# Altium project PCrs_30.PrjPcb
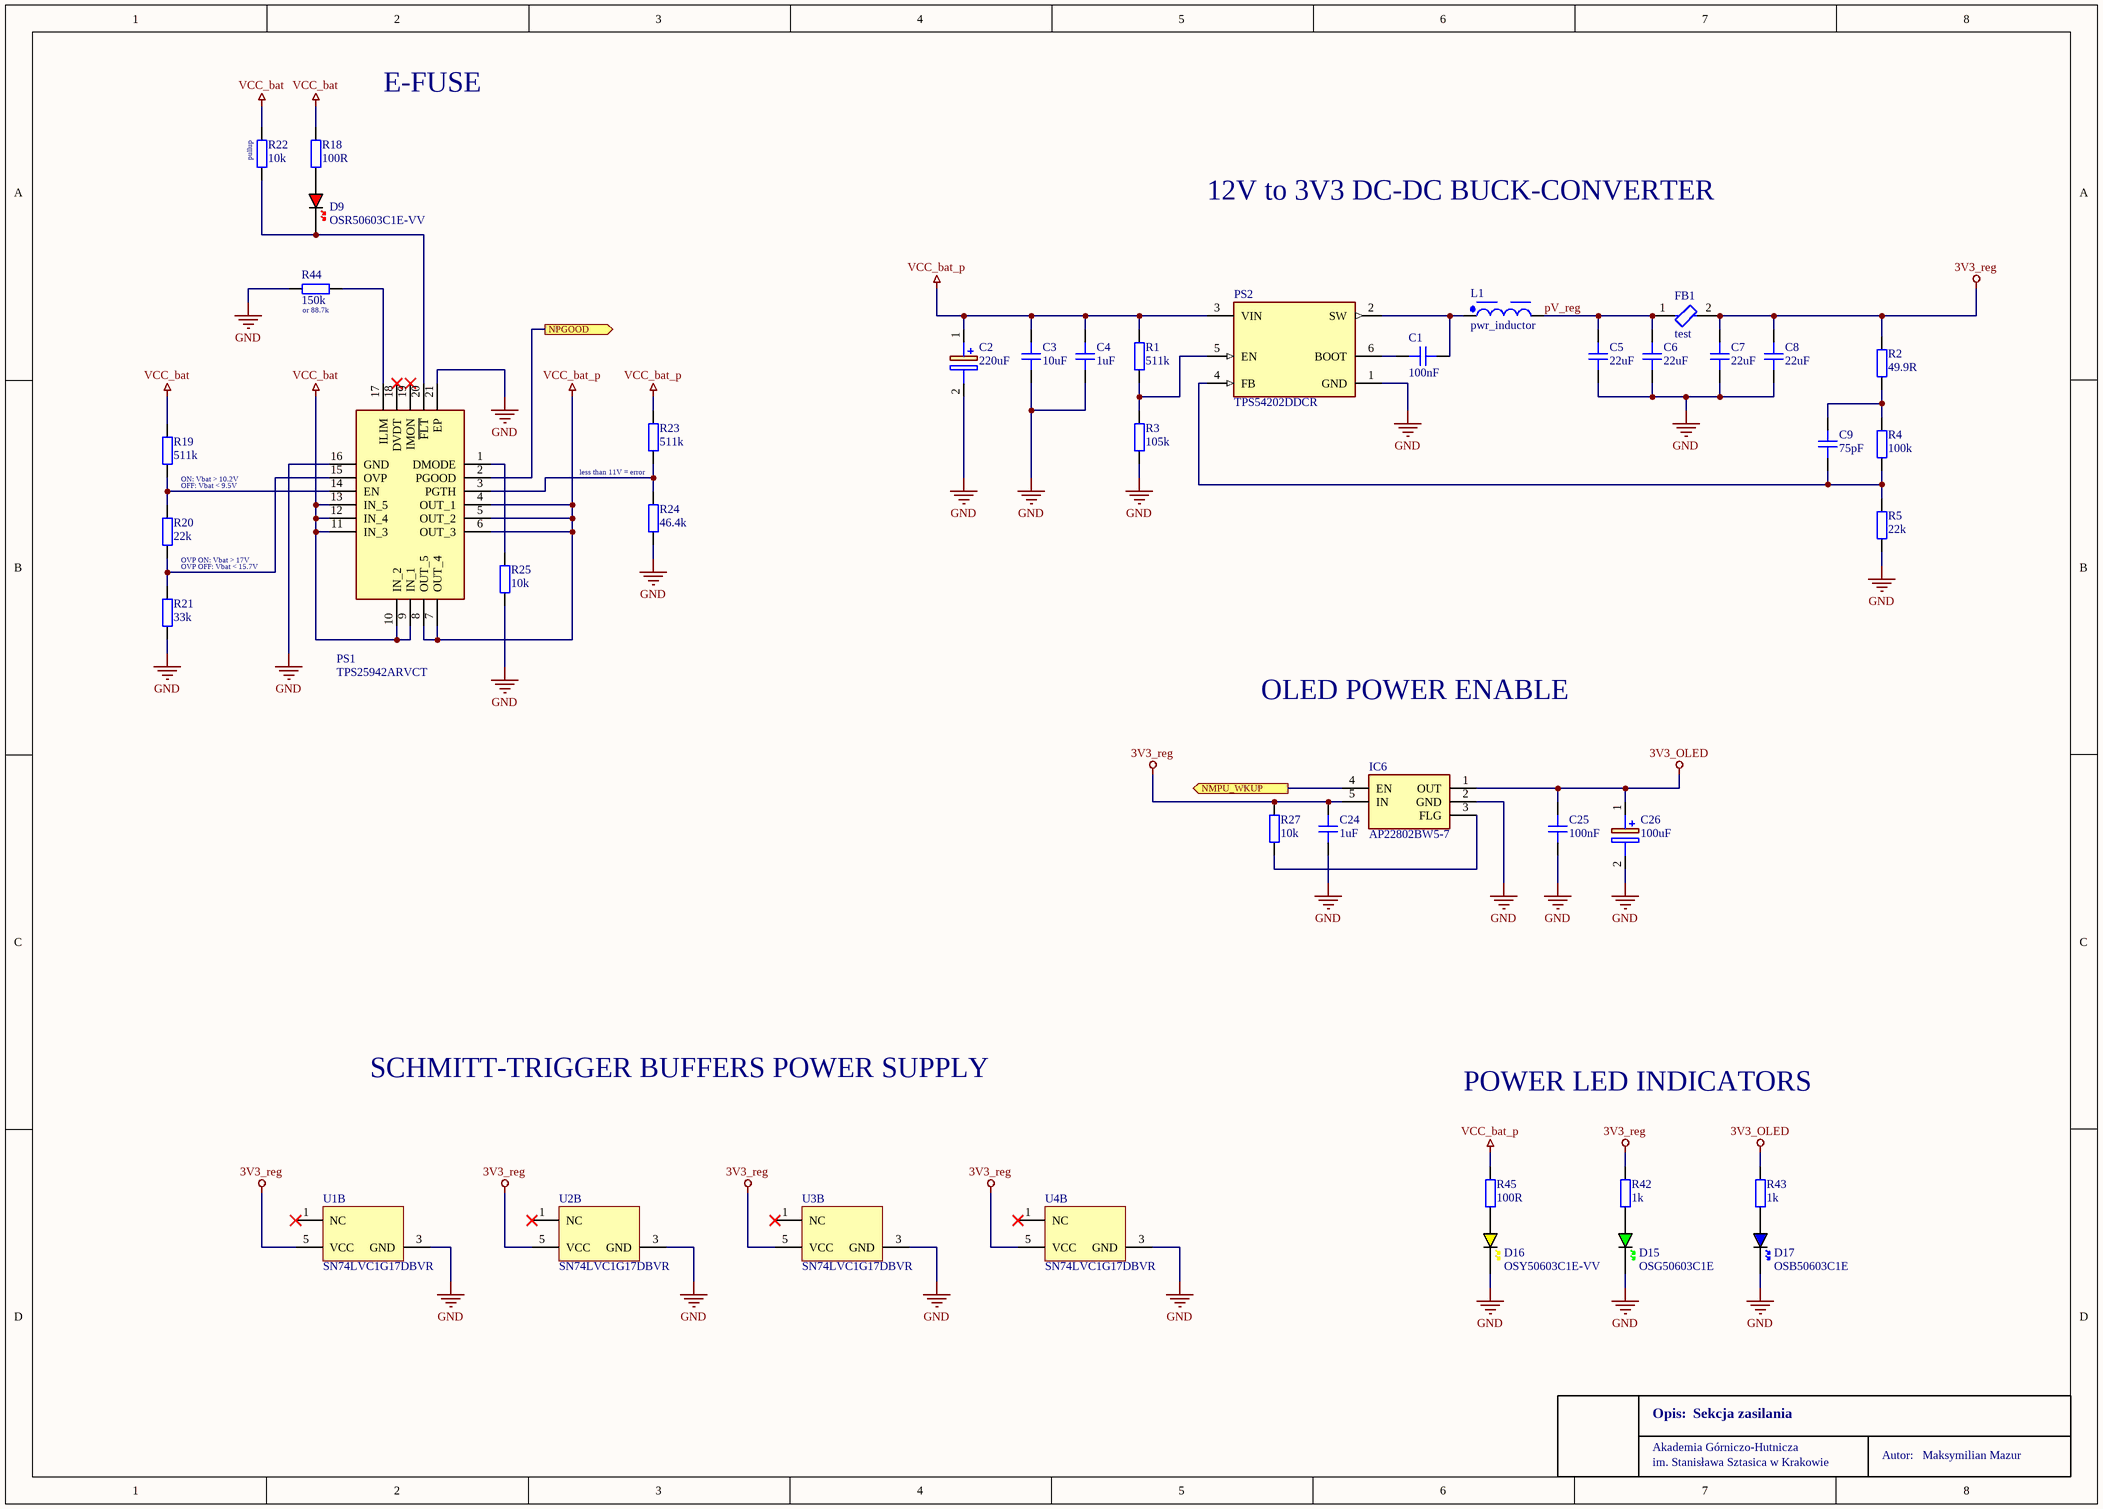
[diagram p0: PowerSupply.SchDoc]
3 sheets, 102 parts. Net scope: flat (ports and power ports of the same name join across sheets).
Board file: Mainboard.PcbDoc
Sheets:
  PowerSupply.SchDoc
  Connectors.SchDoc
  Buffers.SchDoc

## Sheet PowerSupply.SchDoc
size A3; SheetNumber: 1; SheetTotal: 4

### Parts
C1  100nF  [CAP_0603]
C2  220uF  [CAPAE660X810N]
C3  10uF  [CAP_1206]
C4  1uF  [CAP_0603]
C5  22uF  [CAP_0603]
C6  22uF  [CAP_0603]
C7  22uF  [CAP_0603]
C8  22uF  [CAP_0603]
C9  75pF  [CAP_0603]
C24  1uF  [CAP_0603]
C25  100nF  [CAP_0603]
C26  100uF  [CAPPM3528X210N]
D9  OSR50603C1E-VV  [LED_0603_RED]
D15  OSG50603C1E  [LED_0603_GREEN]
D16  OSY50603C1E-VV  [LED_0603_YELLOW]
D17  OSB50603C1E  [LED_0603_BLUE]
FB1  test  [FP-BLM18-0_15-t0_8-IPC_A]
IC6  AP22802BW5-7  [SOT95P285X140-5N]
L1  pwr_inductor  [WE-PD_7345]
PS1  TPS25942ARVCT  [QFN50P300X400X80-21N]
PS2  TPS54202DDCR  [FP-DDC0006A-IPC_B]
R1  511k  [RES_0603]
R2  49.9R  [RES_0603]
R3  105k  [RES_0603]
R4  100k  [RES_0603]
R5  22k  [RES_0603]
R18  100R  [RES_0603]
R19  511k  [RES_0603]
R20  22k  [RES_0603]
R21  33k  [RES_0603]
R22  10k  [RES_0603]
R23  511k  [RES_0603]
R24  46.4k  [RES_0603]
R25  10k  [RES_0603]
R27  10k  [RES_0603]
R42  1k  [RES_0603]
R43  1k  [RES_0603]
R44  150k  [RES_0603]
R45  100R  [RES_0603]
U1  SN74LVC1G17DBVR  [DBV0005A_L]  (part B of 2)
U2  SN74LVC1G17DBVR  [DBV0005A_L]  (part B of 2)
U3  SN74LVC1G17DBVR  [DBV0005A_L]  (part B of 2)
U4  SN74LVC1G17DBVR  [DBV0005A_L]  (part B of 2)

### Ports
NMPU_WKUP (out, see Buffers[3C], MPU[5C]), NPGOOD (out, see MPU[5C])

### Nets
3V3_OLED: C25.2 C26.1(+) IC6.1(OUT) R43.2
3V3_reg: C7.2 C8.2 C24.2 FB1.2 IC6.5(IN) R2.2 R27.2 R42.2 U1.5(VCC) U2.5(VCC) U3.5(VCC) U4.5(VCC)  [project net VDD]
GND: C2.2(-) C3.1 C4.1 C5.1 C6.1 C7.1 C8.1 C24.1 C25.1 C26.2(-) D15.K D16.K D17.K IC6.2(GND) PS1.16(GND) PS1.21(EP) PS2.1(GND) R3.1 R5.2 R21.1 R24.1 R25.1 R44.2 U1.3(GND) U2.3(GND) U3.3(GND) U4.3(GND)
VCC_bat: PS1.9(IN_1) PS1.10(IN_2) PS1.11(IN_3) PS1.12(IN_4) PS1.13(IN_5) R18.2 R19.2 R22.2  [project net VCC_bat_con]
VCC_bat_p: C2.1(+) C3.2 C4.2 PS1.4(OUT_1) PS1.5(OUT_2) PS1.6(OUT_3) PS1.7(OUT_4) PS1.8(OUT_5) PS2.3(VIN) R1.2 R23.2 R45.2
pV_reg: C5.2 C6.2 FB1.1 L1.2
NetC1_1: C1.1 L1.1 PS2.2(SW)
NetC1_2: C1.2 PS2.6(BOOT)
NetC9_1: C9.1 PS2.4(FB) R4.1 R5.1
NetC9_2: C9.2 R2.1 R4.2
NetD9_A: D9.A R18.1
NetD9_K: D9.K PS1.20(~{FLT}) R22.1
NetD15_A: D15.A R42.1
NetD16_A: D16.A R45.1
NetD17_A: D17.A R43.1
NetIC6_3: IC6.3(FLG) R27.1
NetIC6_4: IC6.4(EN) ; port NMPU_WKUP
NetPS1_1: PS1.1(DMODE) R25.2
NetPS1_2: PS1.2(PGOOD) ; port NPGOOD
NetPS1_3: PS1.3(PGTH) R23.1 R24.2
NetPS1_14: PS1.14(EN) R19.1 R20.2
NetPS1_15: PS1.15(OVP) R20.1 R21.2
NetPS1_17: PS1.17(ILIM) R44.1
NetPS2_5: PS2.5(EN) R1.1 R3.2

Not connected (* = marked no-connect by the designer): PS1 18(DVDT)* 19(IMON)*; U1 1(NC)*; U2 1(NC)*; U3 1(NC)*; U4 1(NC)*

### Notes on the sheet
- E-FUSE
- (near R22) pullup
- 12V to 3V3 DC-DC BUCK-CONVERTER
- (near R44) or 88.7k
- (near R19) ON: Vbat > 10.2V
- OFF: Vbat < 9.5V
- less than 11V = error
- (near R20) OVP ON: Vbat > 17V
- OVP OFF: Vbat < 15.7V
- OLED POWER ENABLE
- SCHMITT-TRIGGER BUFFERS POWER SUPPLY
- POWER LED INDICATORS
- Akademia Górniczo-Hutnicza
- Opis:
- Sekcja zasilania
- Autor:
- Maksymilian Mazur
- im. Stanisława Sztasica w Krakowie

### Library data of the parts
C1 C5-C8 = CAP_0603: Capacitor SMD 0603 / X7R / LOW ESR; Manufacturer: *; Manufacturer Part Number: *; Distributor Link: *; LCSC: *; Rating: *; Dielectric: *
C2 = SC1C227M6L07KVR: Capacitor Polarised / 220uF 16V / SC1C227M6L07KVR; Manufacturer_Name: SAMWHA; Datasheet Link: https://octopart.com/datasheet/sc1c227m6l07kvr-samwha-30812620; Height: 8.1mm; Manufacturer_Part_Number: SC1C227M6L07KVR
C3 = CAP_1206: Capacitor SMD 1206 / 25V; Manufacturer: *; Manufacturer Part Number: *; Distributor Link: *; LCSC: *; Rating: *; Dielectric: *
C4 = CAP_0603: Capacitor SMD 0603 / 25V; Manufacturer: *; Manufacturer Part Number: *; Distributor Link: *; LCSC: *; Rating: *; Dielectric: *
C9 C24 C25 = CAP_0603: Capacitor SMD 0603; Manufacturer: *; Manufacturer Part Number: *; Distributor Link: *; LCSC: *; Rating: *; Dielectric: *
C26 = TAJB107M010RNJ: Kyocera AVX / TAJB107M010RNJ; Datasheet Link: http://datasheets.avx.com/TAJ.pdf; Height: 2.1mm; Manufacturer_Name: Kyocera AVX; Manufacturer_Part_Number: TAJB107M010RNJ; Mouser Part Number: 581-TAJB107M010R; Mouser Price/Stock: https://www.mouser.co.uk/ProductDetail/KYOCERA-AVX/TAJB107M010RNJ?qs=fdqkYiOtZpcLl77pdaUmPA%3D%3D; Arrow Part Number: TAJB107M010RNJ; Arrow Price/Stock: https://www.arrow.com/en/products/tajb107m010rnj/avx?utm_currency=USD&region=europe
D9 = LED_0603_RED: LED 0603 RED SMD / Model: OSR50603C1E
D15 = LED_0603_GREEN: LED 0603 GREEN SMD / OSG50603C1E
D16 = LED_0603_YELLOW: LED 0603 YELLOW SMD / OSY50603C1E-VV
D17 = LED_0603_BLUE: LED 0603 BLUE SMD
FB1 = CMP-0686-00557-7: Chip Ferrite Bead, 0603 / For testing purpose; Impedance: 120R; Frequency: 100MHz; Number of Circuits: 1; Max Current Rating: 2A; Shielding: Unshielded; Material: Steel; DC Resistance (DCR): 50mR; Tolerance: 25%; Case Code (Imperial): 0603; RoHS Compliant: Yes; Number of Pins: 2; Min Operating Temperature: -55°C; Case Code (Metric): 1608; Length: 1.6mm; Test Frequency: 100MHz; Max Operating Temperature: 125°C; Packaging: Tape and Reel; Termination: SMD/SMT; Lead Free: Lead Free; Max DC Current: 2A; Case/Package: 0603; Height: 0.8mm; Current Rating: 2A; Radiation Hardening: No; Core Material: Ferrite; DC Current: 2A; REACH SVHC: No SVHC; Package Quantity: 1; Depth: 0.8mm; Number of Lines: 1; Width: 0.8mm
IC6 = AP22802BW5-7: Integrated Circuit; Manufacturer_Name: Diodes Incorporated; Datasheet Link: https://www.diodes.com//assets/Datasheets/products_inactive_data/AP22802.pdf; Height: 1.4mm; Manufacturer_Part_Number: AP22802BW5-7; Mouser Part Number: 621-AP22802BW5-7; Mouser Price/Stock: https://www.mouser.co.uk/ProductDetail/Diodes-Incorporated/AP22802BW5-7?qs=4WD8WRWcnWvdREmNWulNnQ%3D%3D; Arrow Part Number: AP22802BW5-7; Arrow Price/Stock: https://www.arrow.com/en/products/ap22802bw5-7/diodes-incorporated?utm_currency=USD&region=asia
L1 = CMP-0227-00155-2: 15uF, 2.7A  HPI0630-150; NexarPartId: 31136509; Self Resonant Frequency: 9.5MHz; Inductance: 15µH; Tolerance: 20%; DC Resistance (DCR): 110mΩ; Shielding: Shielded; Ambient Temperature Range Low: -40°C; Depth: 7.3mm; Max Operating Temperature: 125°C; Length: 7.3mm; Max DC Current: 2.7A; Height: 4.5mm; Current Rating: 2.7A; Width: 7.3mm; Number of Pins: 2; Min Operating Temperature: -40°C; Ambient Temperature Range High: 85°C; RoHS: Compliant; Packaging: Tape & Reel
PS1 = TPS25942ARVCT: Power Supply; Manufacturer_Name: Texas Instruments; Datasheet Link: https://www.arrow.com/en/products/tps25942arvct/texas-instruments; Height: 0.8mm; Manufacturer_Part_Number: TPS25942ARVCT; Mouser Part Number: 595-TPS25942ARVCT; Mouser Price/Stock: https://www.mouser.co.uk/ProductDetail/Texas-Instruments/TPS25942ARVCT?qs=1MXlzafEN38%2FhNIOFl0fzQ%3D%3D; Arrow Part Number: TPS25942ARVCT; Arrow Price/Stock: https://www.arrow.com/en/products/tps25942arvct/texas-instruments?utm_currency=USD&region=nac
PS2 = CMP-04918-000439-1: IC REG BUCK ADJ 2A TSOT23-6; Switching Frequency: 500kHz; Quiescent Current: 40uA; Max Output Voltage: 28V; Output Configuration: Positive; Min Output Voltage: 596mV; Min Input Voltage: 4.5V; Synchronous Rectifier: Yes; Output Type: Adjustable; Number of Outputs: 1; Packaging: Tape and Reel; Case/Package: SOT-23-6; RoHS Compliant: Yes; Max Input Voltage: 28V; Max Operating Temperature: 125°C; Min Operating Temperature: -40°C; Output Current: 2A; Lead Free: Lead Free; Mount: Surface Mount; ComponentLink1Description: datasheet; ComponentLink1URL: https://www.ti.com/lit/ds/symlink/tps54202.pdf
R1-R3 R18-R25 R27 R42-R45 = RES_0603: Resistor SMD 0603; Manufacturer: *; Manufacturer Part Number: *; Distributor Link: *; LCSC: *
R4 R5 = RES_0603: Resistor SMD 0603 / Tolerance 1%; Manufacturer: *; Manufacturer Part Number: *; Distributor Link: *; LCSC: *
U1-U4 = CMP-0859-00033-4: Single Schmitt-Trigger Buffer, DBV0005A, LARGE T&R; Manufacturer: Texas Instruments; Output Drive (IOL/IOH)(Max)(mA): 32/-32; Technology Family: LVC; ICC @ Nom Voltage(Max)(mA): 0.01; VCC(Min)(V): 1.65; F @ Nom Voltage(Max)(Mhz): 150; Schmitt Trigger: Yes; Voltage(Nom)(V): 1.8,2.5,3.3,5; 3-State Output: No; Bits(#): 1; VCC(Max)(V): 5.5; Input Type: CMOS/TTL; Logic: True; tpd @ Nom Voltage(Max)(ns): 11,6.5,5.5,5; Output Type: CMOS; Rating: Catalog; Sub-Family: Non-Inverting Buffer/Driver; PackageReference: DBV0005A; DatasheetVersion: SCES351V; Generic Part Number: SN74LVC1G17; Operating Temperature Range(C): -40 to 125,-40 to 85

## Sheet Connectors.SchDoc
size A4; SheetNumber: 3; SheetTotal: 4
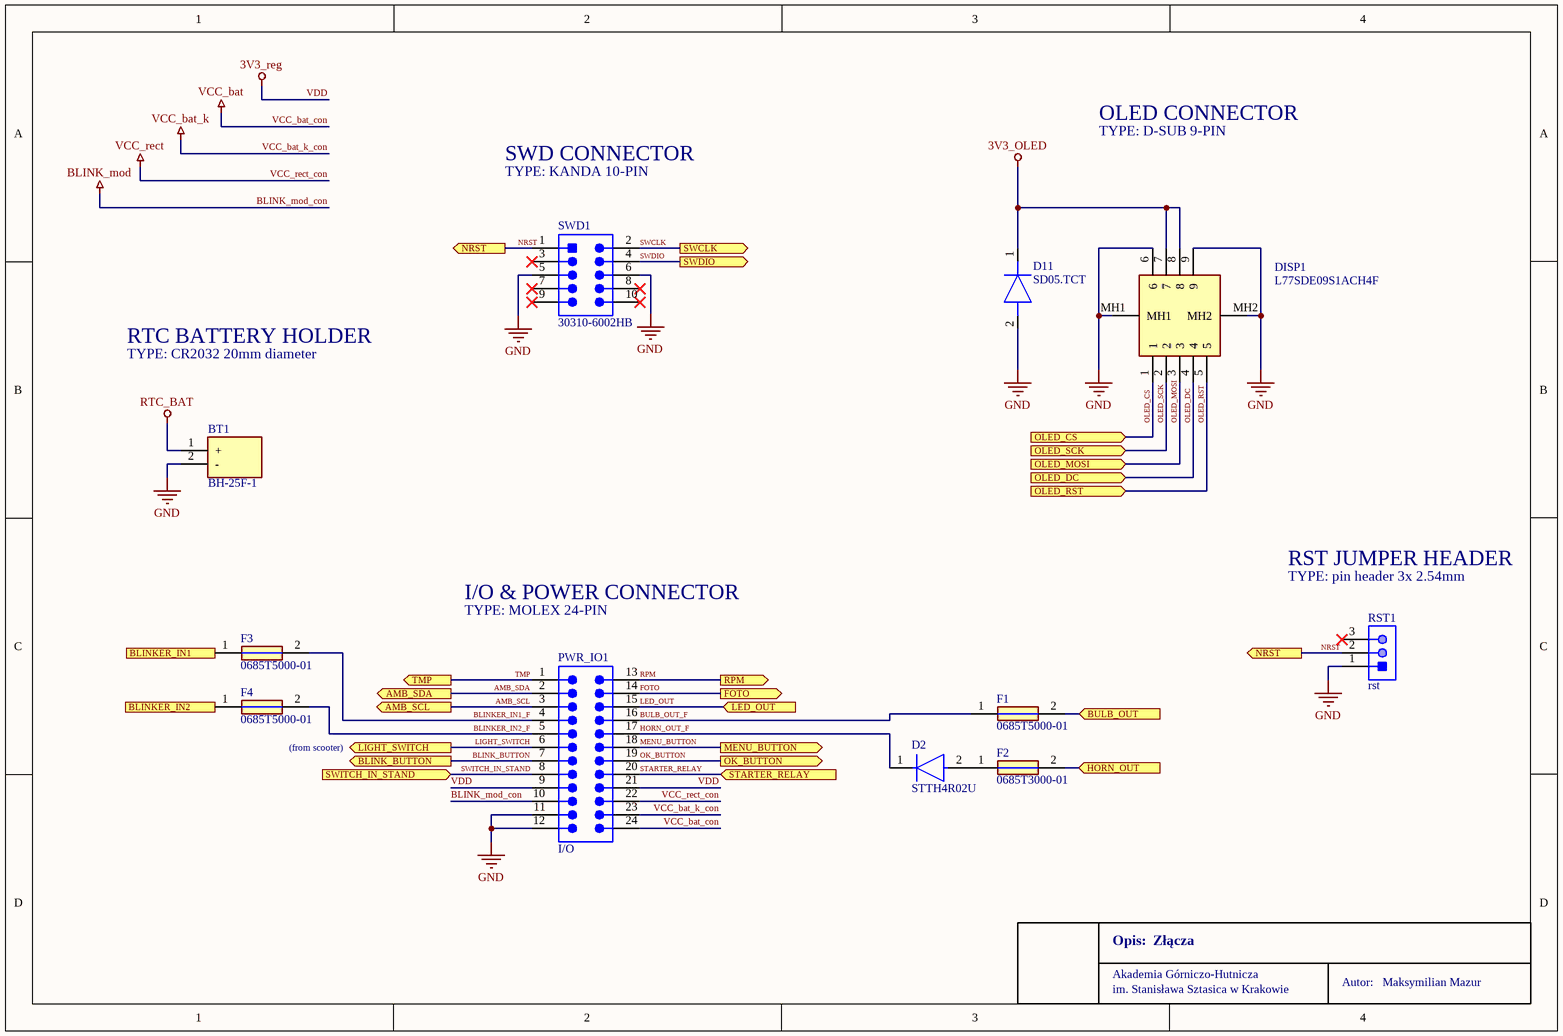
[diagram p1: Connectors.SchDoc]

### Parts
BT1  BH-25F-1  [BH25F1]
D2  STTH4R02U  [FP-SMB-MFG]
D11  SD05.TCT  [SOD2513X110N]
DISP1  L77SDE09S1ACH4F  [L77SDE09S1ACH4F]
F1  0685T5000-01  [FUSC3216X83N]
F2  0685T3000-01  [FUSC3216X83N]
F3  0685T5000-01  [FUSC3216X83N]
F4  0685T5000-01  [FUSC3216X83N]
PWR_IO1  I/O  [649024227222]
RST1  rst  [MOLX-22-28-4033_V]
SWD1  30310-6002HB  [3M-30310-6002HB-10_V]

### Ports
AMB_SCL (out, see Buffers[4B]), AMB_SDA (out, see Buffers[4A]), BLINK_BUTTON (out, see Buffers[4D]), BLINKER_IN1 (out, see MPU[1C]), BLINKER_IN2 (out, see MPU[2C]), BULB_OUT (in, see MPU[2C]), FOTO (out, see Buffers[1B]), HORN_OUT (in, see MPU[2D]), LED_OUT (in, see MPU[2C]), LIGHT_SWITCH (out, see MPU[2B]), MENU_BUTTON (out, see Buffers[4C]), NRST (out, see Connectors[2A], MPU[5C]), NRST (out, see Connectors[4C], MPU[5C]), OK_BUTTON (out, see Buffers[4C]), OLED_CS (in, see MPU[5D]), OLED_DC (in, see MPU[5D]), OLED_MOSI (in, see MPU[5D]), OLED_RST (in, see MPU[5D]), OLED_SCK (in, see MPU[5D]), RPM (out, see Buffers[1D]), STARTER_RELAY (in, see MPU[2C]), SWCLK (out, see MPU[6B]), SWDIO (out, see MPU[7B]), SWITCH_IN_STAND (in, see MPU[2C]), TMP (out, see Buffers[1A])

### Nets
3V3_OLED: D11.1(K) DISP1.7 DISP1.8
BLINK_mod_con: PWR_IO1.10  [also labelled BLINK_mod]
GND: BT1.2(-) D11.2(A) DISP1.6 DISP1.9 DISP1.MH1 DISP1.MH2 PWR_IO1.11 PWR_IO1.12 RST1.1 SWD1.5 SWD1.6
RTC_BAT: BT1.1(+)
VCC_bat_con: PWR_IO1.24  [also labelled VCC_bat]
VCC_bat_k_con: PWR_IO1.23  [also labelled VCC_bat_k]
VCC_rect_con: PWR_IO1.22  [also labelled VCC_rect]
VDD: PWR_IO1.9 PWR_IO1.21  [also labelled 3V3_reg]
AMB_SCL: PWR_IO1.3 ; port AMB_SCL
AMB_SDA: PWR_IO1.2 ; port AMB_SDA
BLINK_BUTTON: PWR_IO1.7 ; port BLINK_BUTTON
BLINKER_IN1_F: F3.2 PWR_IO1.4
BLINKER_IN2_F: F4.2 PWR_IO1.5
BULB_OUT_F: F1.1 PWR_IO1.16
FOTO: PWR_IO1.14 ; port FOTO
HORN_OUT_F: D2.1(K) PWR_IO1.17
LED_OUT: PWR_IO1.15 ; port LED_OUT
LIGHT_SWITCH: PWR_IO1.6 ; port LIGHT_SWITCH
MENU_BUTTON: PWR_IO1.18 ; port MENU_BUTTON
NRST: RST1.2 SWD1.1 ; port NRST
OK_BUTTON: PWR_IO1.19 ; port OK_BUTTON
OLED_CS: DISP1.1 ; port OLED_CS
OLED_DC: DISP1.4 ; port OLED_DC
OLED_MOSI: DISP1.3 ; port OLED_MOSI
OLED_RST: DISP1.5 ; port OLED_RST
OLED_SCK: DISP1.2 ; port OLED_SCK
RPM: PWR_IO1.13 ; port RPM
STARTER_RELAY: PWR_IO1.20 ; port STARTER_RELAY
SWCLK: SWD1.2 ; port SWCLK
SWDIO: SWD1.4 ; port SWDIO
SWITCH_IN_STAND: PWR_IO1.8 ; port SWITCH_IN_STAND
TMP: PWR_IO1.1 ; port TMP
NetD2_2: D2.2(A) F2.1
NetF1_2: F1.2 ; port BULB_OUT
NetF2_2: F2.2 ; port HORN_OUT
NetF3_1: F3.1 ; port BLINKER_IN1
NetF4_1: F4.1 ; port BLINKER_IN2

Not connected (* = marked no-connect by the designer): RST1 3*; SWD1 3* 7* 8* 9* 10*

### Notes on the sheet
- SWD CONNECTOR
- TYPE: KANDA 10-PIN
- OLED CONNECTOR
- TYPE: D-SUB 9-PIN
- RTC BATTERY HOLDER
- TYPE: CR2032 20mm diameter
- RST JUMPER HEADER
- TYPE: pin header 3x 2.54mm
- I/O & POWER CONNECTOR
- TYPE: MOLEX 24-PIN
- (near F4) (from scooter)
- Akademia Górniczo-Hutnicza
- Opis:
- Złącza
- Autor:
- Maksymilian Mazur
- im. Stanisława Sztasica w Krakowie

### Library data of the parts
BT1 = BH-25F-1: Battery; Manufacturer_Name: Adam Tech; Datasheet Link: https://app.adam-tech.com/products/download/data_sheet/196966/bh-25f-1-data-sheet.pdf; Height: 9.5mm; Manufacturer_Part_Number: BH-25F-1; Mouser Part Number: 737-BH-25F-1; Mouser Price/Stock: https://www.mouser.co.uk/ProductDetail/Adam-Tech/BH-25F-1?qs=HoCaDK9Nz5dcCnxRauSciw%3D%3D; Arrow Part Number: BH-25F-1; Arrow Price/Stock: https://www.arrow.com/en/products/bh-25f-1/adam-tech?utm_currency=USD&region=europe
D2 = CMP-12188-000005-1: DIODE GEN PURP 200V 4A SMB; Manufacturer: STMicroelectronics; Peak Reverse Current: 3uA; Standoff Height: 0.05mm; Max Junction Temp: +175°C; Max Surge Forward Current: 70A; Forward Current: 4A; Manufacturer Part Number: STTH4R02U; Device Class L3: Rectifier Diodes; Package: SMB; Lead Free: Yes; Category: Diode; Height: 2.65mm; Digikey Description: DIODE GEN PURP 200V 4A SMB; Temperature: to +175°C; Mouser Description: Rectifiers RECTIFIER; ComponentLink2URL: https://www.st.com/resource/en/datasheet/stth4r02.pdf; ComponentLink2Description: Datasheet; Max Repetitive Reverse Voltage: 200V; Device Class L2: Diodes; Temperature Range High: +175°C; Device Class L1: Discrete Semiconductors; RoHS: TRUE; Octopart: https://octopart.com/stth4r02u-stmicroelectronics-324581; Automotive: No
D11 = SD05.TCT: Diode; Manufacturer_Name: SEMTECH; Datasheet Link: https://datasheet.datasheetarchive.com/originals/distributors/Datasheets-DGA26/1841681.pdf; Height: 1.1mm; Manufacturer_Part_Number: SD05.TCT; Mouser Part Number: 947-SD05.TCT; Mouser Price/Stock: https://www.mouser.co.uk/ProductDetail/Semtech/SD05.TCT?qs=rBWM4%252BvDhIed78qt1y4o0Q%3D%3D; Arrow Part Number: SD05.TCT; Arrow Price/Stock: https://www.arrow.com/en/products/sd05.tct/semtech?utm_currency=USD&region=nac
DISP1 = L77SDE09S1ACH4F: Connector; Manufacturer_Name: Amphenol Communications Solutions; Datasheet Link: https://cdn.amphenol-cs.com/media/wysiwyg/files/drawing/l77sdxxxs1ach4f.pdf; Height: 12.93mm; Manufacturer_Part_Number: L77SDE09S1ACH4F; Mouser Part Number: 523-L77SDE09S1ACH4F; Mouser Price/Stock: https://www.mouser.com/Search/Refine.aspx?Keyword=523-L77SDE09S1ACH4F
F1 F3 F4 = 0685T3000-01: Fuse 5A / 63VAC/63VDC / 1206; Manufacturer_Name: BelFuse; Datasheet Link: https://www.belfuse.com/resources/datasheets/circuitprotection/ds-cp-c1t-series.pdf; Height: 0.83mm; Manufacturer_Part_Number: 0685T3000-01; Arrow Part Number: 0685T3000-01; Arrow Price/Stock: https://www.arrow.com/en/products/0685t3000-01/bel-group
F2 = 0685T3000-01: Fuse 3A / 63VAC/63VDC / 1206; Manufacturer_Name: BelFuse; Datasheet Link: https://www.belfuse.com/resources/datasheets/circuitprotection/ds-cp-c1t-series.pdf; Height: 0.83mm; Manufacturer_Part_Number: 0685T3000-01; Arrow Part Number: 0685T3000-01; Arrow Price/Stock: https://www.arrow.com/en/products/0685t3000-01/bel-group
PWR_IO1 = CMP-1502-00539-2: NexarPartId: 23024662; Pitch: 4.2mm; Number of Contacts: 24; Operating Supply Voltage: 600V; Contact Resistance: 10mΩ; Row Spacing: 4.191mm; Current Rating: 6A; Connector Type: Male Pin, Socket; Insulation Resistance: 1GΩ; Gender: Male; Contact Plating: Tin; Max Operating Temperature: 105°C; Length: 51.6mm; Color: White; Termination: Solder; Number of Pins: 24; Lead Pitch: 4.2mm; Number of Positions: 24; REACH SVHC: Unknown; Contact Material: Copper; Fastening Type: Ramp; Number of Rows: 2; Height: 12.8mm; Min Operating Temperature: -40°C; RoHS: Compliant; Mount: Through Hole; Width: 51.7mm
RST1 = CMP-1676-00001-5: Male Header, Pitch 2.54 mm, 1 x 3 Position, Height 8.38 mm, Tail Length 3.18 mm, RoHS, Bulk; Manufacturer: Molex; Rows: 1; Voltage Rating: 250 V; Current Rating: 4 A; Min Operating Temperature: 0 degC; Lead Pitch: 0.1 inch; Packaging: Bulk; Contact Finish: Gold; RoHSCompliant: true; Contact Material: Brass; PackageReference: 22-28-4033; REACH SVHC: Unknown; PackageDescription: Male Header, Pitch 2.54 mm, 1 x 3 Position, Height 8.38 mm, Tail Length 3.18 mm; ComponentLink2URL: http://www.molex.com/pdm_docs/sd/022284033_sd.pdf; Height: 8.38 mm; Mounting Technology: Through Hole; ComponentLink1Description: Manufacturer URL; Length: 7.62 mm; Mount: Through Hole; DatasheetVersion: Rev. G, 01/2012; Max Operating Temperature: 75 degC; ComponentLink2Description: Datasheet; Colour: Black; Pins: 3; Contact Plating: Gold; Package Quantity: 1; ComponentLink1URL: http://www.molex.com/
SWD1 = CMP-2000-05031-1: Male Header, Pitch 2.54 mm, 2 x 5 Position, Height 9.3 mm, Tail Length 2.79 mm, -55 to 105 degC, RoHS, Bulk; Manufacturer: 3M; Current Rating: 1A; Brand: 3MElectronicSolutionsDivision; Mounting Angle: Straight; Number of Positions: 10Position; Mating Post Length: 5.99mm; Pitch: 2.54mm; Manufacturer URL: http://www.3m.com/; Factory Pack Quantity: 1000; Mounting Style: StraightPin; Number of Rows: 2Row; Termination Post Length: 2.79mm; Contact Gender: Pin(Male); Contact Material: Brass; Termination Style: ThroughHole; Product: Headers; Packaging: Tray; Product Category: Headers&WireHousings; Type: Shrouded; Datasheet URL: http://datasheet.octopart.com/30310-6002HB-3M-datasheet-11537585.pdf; Datasheet Version: Apr-12; Contact Plating: Gold; Row Spacing: 2.54mm; Housing Material: Polyester; Series: 303; RoHS: Details

## Sheet Buffers.SchDoc
size C; SheetNumber: 4; SheetTotal: 4
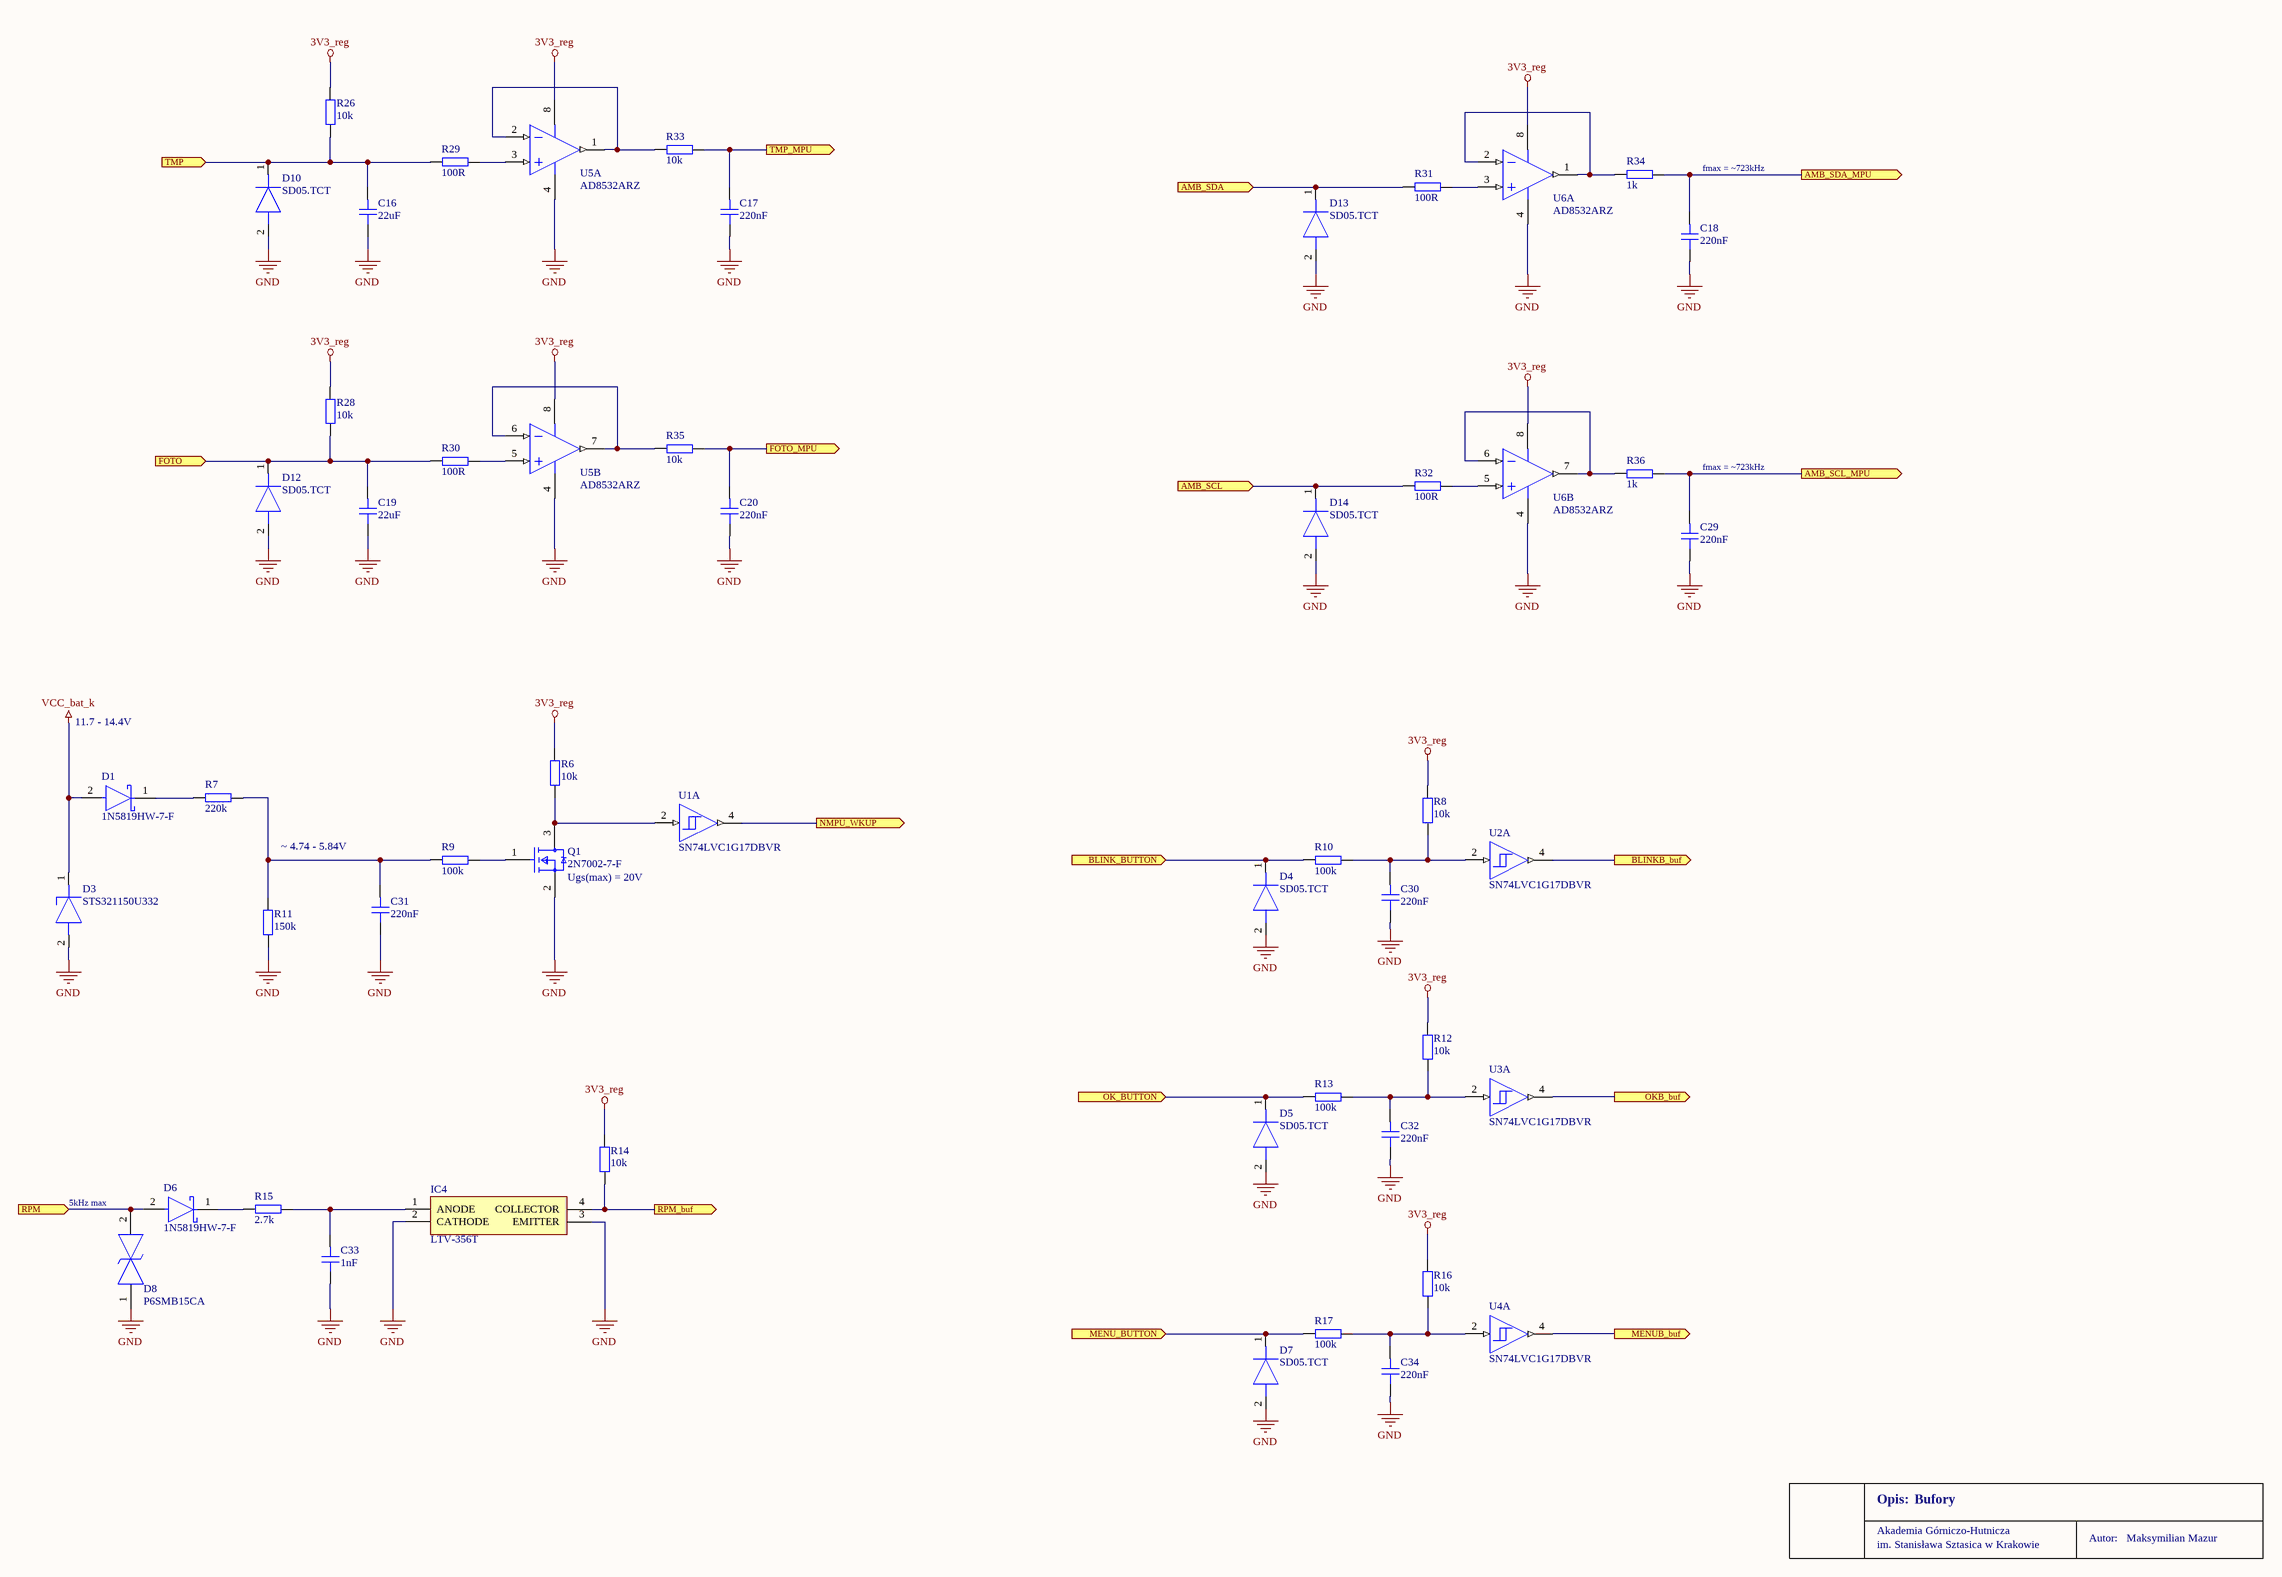
[diagram p2: Buffers.SchDoc]

### Parts
C16  22uF  [CAP_0603]
C17  220nF  [CAP_0603]
C18  220nF  [CAP_0603]
C19  22uF  [CAP_0603]
C20  220nF  [CAP_0603]
C29  220nF  [CAP_0603]
C30  220nF  [CAP_0603]
C31  220nF  [CAP_0603]
C32  220nF  [CAP_0603]
C33  1nF  [CAP_0603]
C34  220nF  [CAP_0603]
D1  1N5819HW-7-F  [FP-SOD123-IPC_A]
D3  STS321150U332  [SOD2613X100N]
D4  SD05.TCT  [SOD2513X110N]
D5  SD05.TCT  [SOD2513X110N]
D6  1N5819HW-7-F  [FP-SOD123-IPC_A]
D7  SD05.TCT  [SOD2513X110N]
D8  P6SMB15CA  [DIONM5436X261N]
D10  SD05.TCT  [SOD2513X110N]
D12  SD05.TCT  [SOD2513X110N]
D13  SD05.TCT  [SOD2513X110N]
D14  SD05.TCT  [SOD2513X110N]
IC4  LTV-356T  [SOP254P675X220-4N]
Q1  2N7002-7-F  [FP-SOT23-MFG]
R6  10k  [RES_0603]
R7  220k  [RES_0603]
R8  10k  [RES_0603]
R9  100k  [RES_0603]
R10  100k  [RES_0603]
R11  150k  [RES_0603]
R12  10k  [RES_0603]
R13  100k  [RES_0603]
R14  10k  [RES_0603]
R15  2.7k  [RES_0603]
R16  10k  [RES_0603]
R17  100k  [RES_0603]
R26  10k  [RES_0603]
R28  10k  [RES_0603]
R29  100R  [RES_0603]
R30  100R  [RES_0603]
R31  100R  [RES_0603]
R32  100R  [RES_0603]
R33  10k  [RES_0603]
R34  1k  [RES_0603]
R35  10k  [RES_0603]
R36  1k  [RES_0603]
U1  SN74LVC1G17DBVR  [DBV0005A_L]  (part A of 2)
U2  SN74LVC1G17DBVR  [DBV0005A_L]  (part A of 2)
U3  SN74LVC1G17DBVR  [DBV0005A_L]  (part A of 2)
U4  SN74LVC1G17DBVR  [DBV0005A_L]  (part A of 2)
U5  AD8532ARZ  [ADI-R-8_L]  (parts A,B of 2)
U6  AD8532ARZ  [ADI-R-8_L]  (parts A,B of 2)

### Ports
AMB_SCL (in, see Connectors[1C]), AMB_SCL_MPU (out, see MPU[7B]), AMB_SDA (in, see Connectors[1C]), AMB_SDA_MPU (out, see MPU[7B]), BLINK_BUTTON (in, see Connectors[1C]), BLINKB_buf (out, see MPU[7C]), FOTO (in, see Connectors[2C]), FOTO_MPU (out, see MPU[6D]), MENU_BUTTON (in, see Connectors[2C]), MENUB_buf (out, see MPU[7C]), NMPU_WKUP (out, see MPU[5C], PowerSupply[5C]), OK_BUTTON (in, see Connectors[2C]), OKB_buf (out, see MPU[7C]), RPM (in, see Connectors[2C]), RPM_buf (out, see MPU[5C]), TMP (in, see Connectors[2C]), TMP_MPU (out, see MPU[6D])

### Nets
3V3_reg: R6.1 R8.1 R12.1 R14.1 R16.1 R26.2 R28.2 U5.8(+V) U6.8(+V)  [project net VDD]
GND: C16.2 C17.2 C18.2 C19.2 C20.2 C29.2 C30.2 C31.2 C32.2 C33.2 C34.2 D3.2(A) D4.2(A) D5.2(A) D7.2(A) D8.1 D10.2(A) D12.2(A) D13.2(A) D14.2(A) IC4.2(CATHODE) IC4.3(EMITTER) Q1.2(S) R11.2 U5.4(-V) U6.4(-V)
VCC_bat_k: D1.2(A) D3.1(K)  [project net VCC_bat_k_con]
AMB_SCL: D14.1(K) R32.2 ; port AMB_SCL
AMB_SDA: D13.1(K) R31.2 ; port AMB_SDA
BLINK_BUTTON: D4.1(K) R10.2 ; port BLINK_BUTTON
FOTO: C19.1 D12.1(K) R28.1 R30.2 ; port FOTO
MENU_BUTTON: D7.1(K) R17.2 ; port MENU_BUTTON
OK_BUTTON: D5.1(K) R13.2 ; port OK_BUTTON
RPM: D6.2(A) D8.2 ; port RPM
TMP: C16.1 D10.1(K) R26.1 R29.2 ; port TMP
NetC17_1: C17.1 R33.1 ; port TMP_MPU
NetC18_1: C18.1 R34.1 ; port AMB_SDA_MPU
NetC20_1: C20.1 R35.1 ; port FOTO_MPU
NetC29_1: C29.1 R36.1 ; port AMB_SCL_MPU
NetC30_1: C30.1 R8.2 R10.1 U2.2(A)
NetC31_1: C31.1 R7.1 R9.2 R11.1
NetC32_1: C32.1 R12.2 R13.1 U3.2(A)
NetC33_1: C33.1 IC4.1(ANODE) R15.1
NetC34_1: C34.1 R16.2 R17.1 U4.2(A)
NetD1_1: D1.1(C) R7.2
NetD6_1: D6.1(C) R15.2
NetIC4_4: IC4.4(COLLECTOR) R14.2 ; port RPM_buf
NetIC6_4: U1.4(Y) ; port NMPU_WKUP
NetQ1_1: Q1.1(G) R9.1
NetQ1_3: Q1.3(D) R6.2 U1.2(A)
NetR29_1: R29.1 U5.3(+IN_A)
NetR30_1: R30.1 U5.5(+IN_B)
NetR31_1: R31.1 U6.3(+IN_A)
NetR32_1: R32.1 U6.5(+IN_B)
NetR33_2: R33.2 U5.1(OUT_A) U5.2(-IN_A)
NetR34_2: R34.2 U6.1(OUT_A) U6.2(-IN_A)
NetR35_2: R35.2 U5.6(-IN_B) U5.7(OUT_B)
NetR36_2: R36.2 U6.6(-IN_B) U6.7(OUT_B)
NetU2_4: U2.4(Y) ; port BLINKB_buf
NetU3_4: U3.4(Y) ; port OKB_buf
NetU4_4: U4.4(Y) ; port MENUB_buf

### Notes on the sheet
- fmax = ~723kHz
- 11.7 - 14.4V
- ~ 4.74 - 5.84V
- (near Q1) Ugs(max) = 20V
- (near D8) 5kHz max
- Akademia Górniczo-Hutnicza
- im. Stanisława Sztasica w Krakowie
- Opis:
- Bufory
- Autor:
- Maksymilian Mazur

### Library data of the parts
C16-C20 C29-C34 = CAP_0603: Capacitor SMD 0603 / X7R / LOW ESR; Manufacturer: *; Manufacturer Part Number: *; Distributor Link: *; LCSC: *; Rating: *; Dielectric: *
D1 D6 = CMP-0303-00003-3: DIODE SCHOTTKY 40V 1A SOD123; Forward Voltage: 450mV; Capacitance: 110pF; Max Forward Surge Current (Ifsm): 25A; Peak Reverse Current: 50uA; Polarity: Standard; Element Configuration: Single; Max Power Dissipation: 450mW; Min Operating Temperature: -65°C; Package Quantity: 3000; Contact Plating: Tin; Weight: 0.000353oz; Max Repetitive Reverse Voltage (Vrrm): 40V; Max Reverse Voltage (DC): 40V; Height: 1.25mm; Average Rectified Current: 1A; Width: 1.7mm; Case/Package: SOD-123-2; Lead Free: Lead Free; Max Operating Temperature: 125°C; Current Rating: 1A; Termination: SMD/SMT; Forward Current: 1A; Radiation Hardening: No; Number of Pins: 2; Length: 2.85mm; Voltage Rating (DC): 40V; REACH SVHC: No SVHC; Peak Non-Repetitive Surge Current: 25A; Packaging: Tape and Reel; Output Current: 1A
D3 = STS321150U751: Diode ESD (Uni-directional) / SOD-323 / 16V 330pF; Manufacturer_Name: Eaton; Datasheet Link: https://www.eaton.com/content/dam/eaton/products/electronic-components/resources/data-sheet/eaton-sts321xxxuxxx-tvs-diode-esd-suppressor-data-sheet.pdf; Height: 1mm; Manufacturer_Part_Number: STS321150U751
D4 D5 D7 D10 D12-D14 = SD05.TCT: Diode; Manufacturer_Name: SEMTECH; Datasheet Link: https://datasheet.datasheetarchive.com/originals/distributors/Datasheets-DGA26/1841681.pdf; Height: 1.1mm; Manufacturer_Part_Number: SD05.TCT; Mouser Part Number: 947-SD05.TCT; Mouser Price/Stock: https://www.mouser.co.uk/ProductDetail/Semtech/SD05.TCT?qs=rBWM4%252BvDhIed78qt1y4o0Q%3D%3D; Arrow Part Number: SD05.TCT; Arrow Price/Stock: https://www.arrow.com/en/products/sd05.tct/semtech?utm_currency=USD&region=nac
D8 = P6SMB15CA: TVS Diode (Bi-directional); Manufacturer_Name: LITTELFUSE; Datasheet Link: https://www.littelfuse.com/~/media/electronics/datasheets/tvs_diodes/littelfuse_tvs_diode_p6smb_datasheet.pdf.pdf; Height: 2.61mm; Manufacturer_Part_Number: P6SMB15CA; Mouser Part Number: 576-P6SMB15CA; Mouser Price/Stock: https://www.mouser.co.uk/ProductDetail/Littelfuse/P6SMB15CA?qs=MLCmBfHNlR44V7NRW6hWSw%3D%3D; Arrow Part Number: P6SMB15CA; Arrow Price/Stock: https://www.arrow.com/en/products/p6smb15ca/littelfuse?region=nac
IC4 = LTV-356T: Integrated Circuit; Manufacturer_Name: Lite-On; Datasheet Link: https://componentsearchengine.com/Datasheets/1/LTV-356T.pdf; Height: 2.2mm; Manufacturer_Part_Number: LTV-356T; Mouser Part Number: 859-LTV-356T; Mouser Price/Stock: https://www.mouser.co.uk/ProductDetail/LITEON/LTV-356T?qs=30I3lYpOJSWvIikXPmhOGQ%3D%3D; Arrow Part Number: LTV-356T; Arrow Price/Stock: https://www.arrow.com/en/products/ltv-356t/lite-on-technology?region=nac
Q1 = CMP-2000-04929-2: MOSFET N-CH 60V 115MA SOT23-3; Turn-On Delay Time: 7ns; Turn-Off Delay Time: 11ns; Drain to Source Resistance: 7.5R; Rise Time: 3ns; Drain to Source Breakdown Voltage: 70V; Input Capacitance: 50pF; Number of Elements: 1; Power Dissipation: 540mW; Max Power Dissipation: 300mW; Fall Time: 5.6ns; Gate to Source Voltage (Vgs): 20V; Threshold Voltage: 2.5V; Element Configuration: Single; Termination: SMD/SMT; Weight: 0.000282oz; Radiation Hardening: No; Max Operating Temperature: 150°C; On-State Resistance: 7.5R; Mount: Surface Mount; Current Rating: 115mA; Contact Plating: Tin; Lead Free: Lead Free; Min Operating Temperature: -55°C; Number of Pins: 3; REACH SVHC: No SVHC; Drain to Source Voltage (Vdss): 60V; Width: 1.3mm; Package Quantity: 3000; Length: 2.9mm; Case/Package: SOT-23; Number of Channels: 1; Dual Supply Voltage: 60V; Packaging: Tape and Reel; Height: 1mm; Voltage Rating (DC): 60V; Nominal Vgs: 2.5V; Continuous Drain Current (ID): 115mA; Voltage: 60V; Rds On Max: 7.5R
R6-R17 R26 R28-R36 = RES_0603: Resistor SMD 0603; Manufacturer: *; Manufacturer Part Number: *; Distributor Link: *; LCSC: *
U1-U4 = CMP-0859-00033-4: as U1 on sheet PowerSupply; PackageReference: DBV0005A; DatasheetVersion: SCES351V; Generic Part Number: SN74LVC1G17; Operating Temperature Range(C): -40 to 125,-40 to 85
U5 U6 = CMP-0384-00999-1: Double Channel Rail-to-Rail Operational Amplifier, 3 MHz BW, 5 V/us SR, Industrial, 8-pin SOIC (R-8), Tube; Generic Part Number: AD8532; Manufacturer: Analog Devices; Slew Rate: 5V/us; Iq/Amp: 1.25mA; Input Offset Voltage: 25mV; V Span Max: 6V; Input Bias Current: 5pA; V Span Min: 3V; Small Signal Bandwidth: 3MHz; Amplifiers Per Package: 2; PackageDescription: 8-Pin Standard Small Outline Package, Body 3.9 x 4.9 mm, Pitch 1.27 mm; Mounting Technology: Surface Mount; ComponentLink3Description: Package Specification; Code_JEDEC: MS-012-AA; ComponentLink1URL: http://www.analog.com/en/index.html; ComponentLink3URL: http://www.analog.com/static/imported-files/packages/PKG_PDF/SOIC_Narrow%20(R)/R_8.pdf; ComponentLink2Description: Datasheet; PackageReference: R-8; ComponentLink1Description: Manufacturer URL; DatasheetVersion: Rev. F; ComponentLink2URL: http://www.analog.com/static/imported-files/data_sheets/AD8531_8532_8534.pdf; PackageVersion: 060506-A; PartNumber: AD8532ARZ

## Nets that join several sheets
3V3_OLED: PowerSupply (C25.2 C26.1 IC6.1 R43.2), Connectors (D11.1 DISP1.7 DISP1.8)
GND: PowerSupply (27 pins), Connectors (11 pins), Buffers (26 pins)
VCC_bat_con: PowerSupply (8 pins), Connectors (PWR_IO1.24)
VCC_bat_k_con: Connectors (PWR_IO1.23), Buffers (D1.2 D3.1)
VDD: PowerSupply (12 pins), Connectors (PWR_IO1.9 PWR_IO1.21), Buffers (9 pins)
AMB_SCL: Connectors (PWR_IO1.3), Buffers (D14.1 R32.2)
AMB_SDA: Connectors (PWR_IO1.2), Buffers (D13.1 R31.2)
BLINK_BUTTON: Connectors (PWR_IO1.7), Buffers (D4.1 R10.2)
FOTO: Connectors (PWR_IO1.14), Buffers (C19.1 D12.1 R28.1 R30.2)
MENU_BUTTON: Connectors (PWR_IO1.18), Buffers (D7.1 R17.2)
NetIC6_4: PowerSupply (IC6.4), Buffers (U1.4)
OK_BUTTON: Connectors (PWR_IO1.19), Buffers (D5.1 R13.2)
RPM: Connectors (PWR_IO1.13), Buffers (D6.2 D8.2)
TMP: Connectors (PWR_IO1.1), Buffers (C16.1 D10.1 R26.1 R29.2)